# EAGLE schematic printer_v1 (EAGLE 9.6.2)
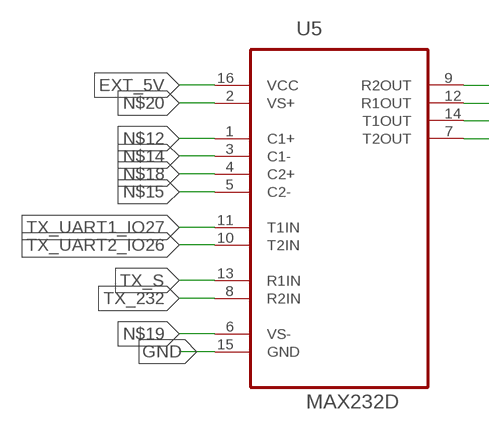
[diagram p0: schematic, sheet 1, part 1 of 2]
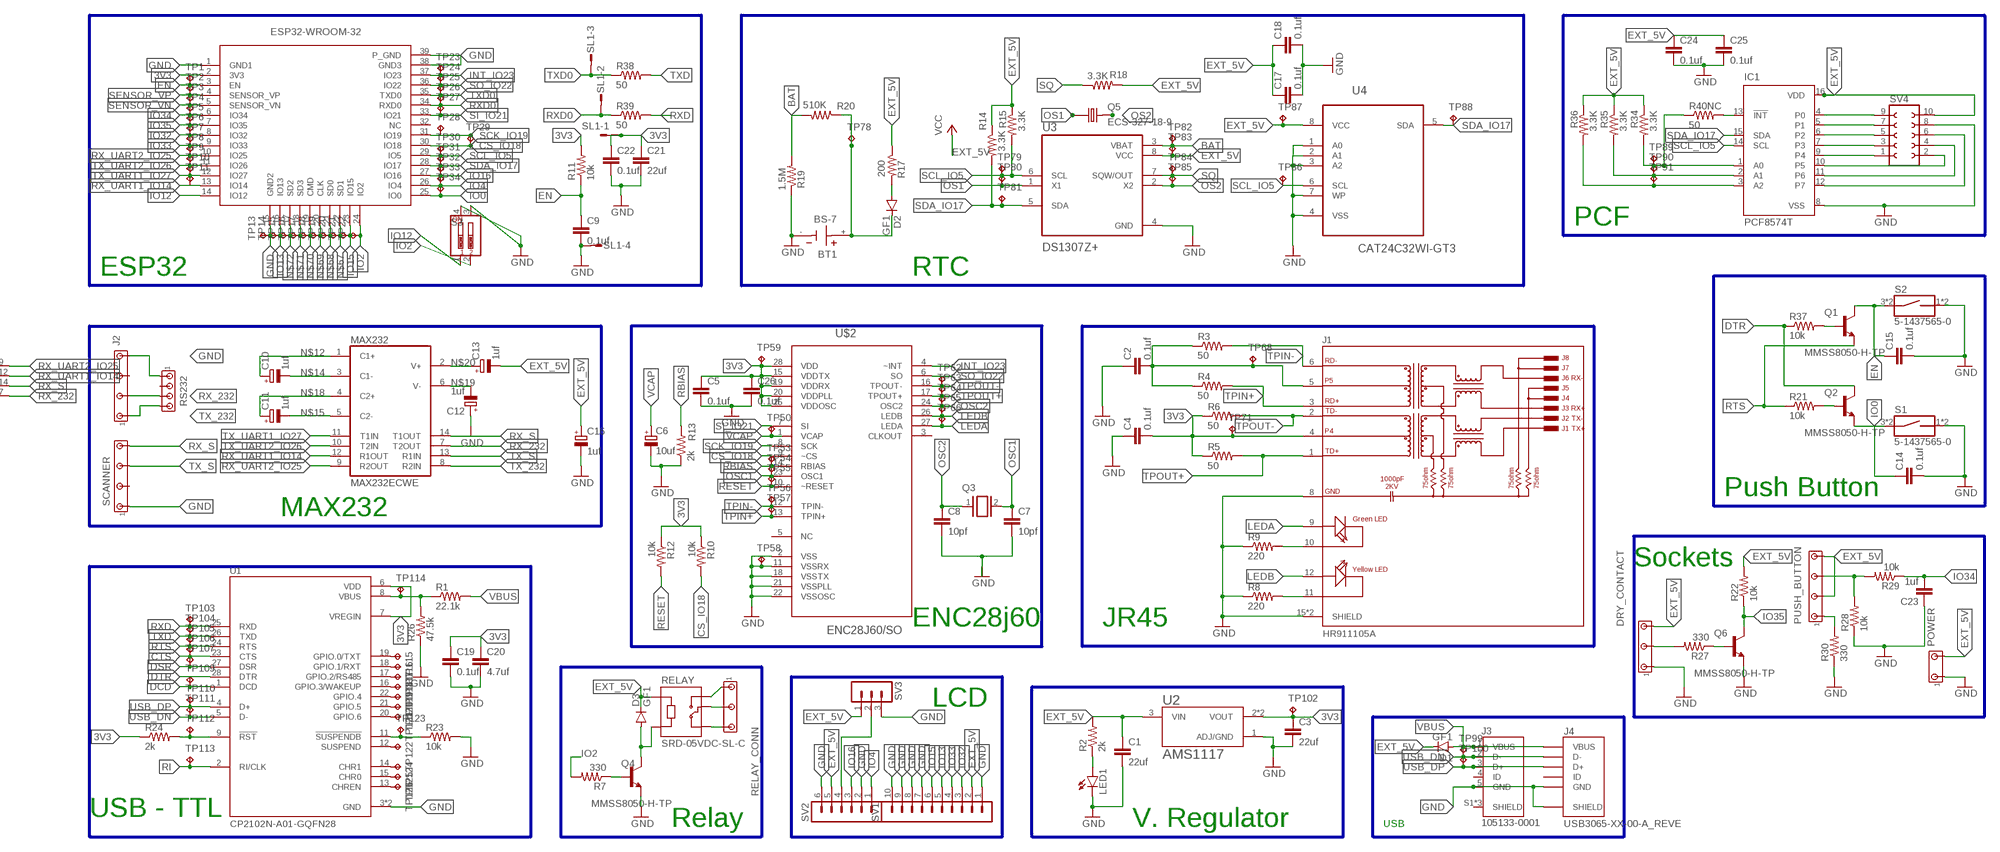
[diagram p1: schematic, sheet 1, part 2 of 2]

## Parts
BT1  BS-7  [BAT_BS-7]
C1  22uf  C-EUC1206  [C1206]
C2  0.1uf  C-EUC1206  [C1206]
C3  22uf  C-EUC1206  [C1206]
C4  0.1uf  C-EUC1206  [C1206]
C5  0.1uf  C-EUC1206  [C1206]
C6  10uf  CPOL-EU153CLV-0405  [153CLV-0405]
C7  10pf  C-EUC1206  [C1206]
C8  10pf  C-EUC1206  [C1206]
C9  0.1uf  C-EUC1206  [C1206]
C10  1uf  CPOL-EU153CLV-0405  [153CLV-0405]
C11  1uf  CPOL-EU153CLV-0405  [153CLV-0405]
C12  1uf  CPOL-EU153CLV-0405  [153CLV-0405]
C13  1uf  CPOL-EU153CLV-0405  [153CLV-0405]
C14  0.1uf  C-EUC1206  [C1206]
C15  0.1uf  C-EUC1206  [C1206]
C16  1uf  CPOL-EU153CLV-0405  [153CLV-0405]
C17  0.1uf  C-EUC1206  [C1206]
C18  0.1uf  C-EUC1206  [C1206]
C19  0.1uf  C-EUC1206  [C1206]
C20  4.7uf  C-EUC1206  [C1206]
C21  22uf  C-EUC1206  [C1206]
C22  0.1uf  C-EUC1206  [C1206]
C23  1uf  C-EUC1206  [C1206]
C24  0.1uf  C-EUC1206  [C1206]
C25  0.1uf  C-EUC1206  [C1206]
C26  0.1uf  C-EUC1206  [C1206]
D1  GF1  [SMA-DO214AC]
D2  GF1  [SMA-DO214AC]
D3  GF1  [SMA-DO214AC]
DRY_CONTACT  MTA05-156_MYVSPACE1  [10X05MTA_MYV]
IC1  PCF8574T  [SO16W]
J1  HR911105A  [HANRUN_HR911105A]
J2  MTA07-100_MYV  [10X07MTA_MYV]
J3  105133-0001  [MOLEX_105133-0001]
J4  USB3065-XX-00-A_REVE  [GCT_USB3065-XX-00-A_REVE]
LED1  LEDSML0603  [SML0603]
MAX232  MAX232ECWE  [SO16L]
POWER  MTA03-100_MYV  [10X03MTA_MYV]
PUSH_BUTTON  MTA07-100_MYV  [10X07MTA_MYV]
Q1  MMSS8050-H-TP  [TRANS_MMSS8050-H-TP]
Q2  MMSS8050-H-TP  [TRANS_MMSS8050-H-TP]
Q3  XTAL/S  [QS]
Q4  MMSS8050-H-TP  [TRANS_MMSS8050-H-TP]
Q5  ECS-327-18-9  [XTAL_ECS-160-18-9X]
Q6  MMSS8050-H-TP  [TRANS_MMSS8050-H-TP]
R1  22.1k  R-US_R1206  [R1206]
R2  2k  R-US_R1206  [R1206]
R3  50  R-US_R1206  [R1206]
R4  50  R-US_R1206  [R1206]
R5  50  R-US_R1206  [R1206]
R6  50  R-US_R1206  [R1206]
R7  330  R-US_R1206  [R1206]
R8  220  R-US_R1206  [R1206]
R9  220  R-US_R1206  [R1206]
R10  10k  R-US_R0805  [R0805]
R11  10k  R-US_R0805  [R0805]
R12  10k  R-US_R0805  [R0805]
R13  2k  R-US_R1206  [R1206]
R14  3.3K  R-US_R1206  [R1206]
R15  3.3K  R-US_R1206  [R1206]
R17  200  R-US_R1206  [R1206]
R18  3.3K  R-US_R1206  [R1206]
R19  1.5M  R-US_R1206  [R1206]
R20  510K  R-US_R1206  [R1206]
R21  10k  R-US_R0805  [R0805]
R22  10k  R-US_R0805  [R0805]
R23  10k  R-US_R0805  [R0805]
R24  2k  R-US_R1206  [R1206]
R26  47.5k  R-US_R1206  [R1206]
R27  330  R-US_R1206  [R1206]
R28  10k  R-US_R0805  [R0805]
R29  10k  R-US_R0805  [R0805]
R30  330  R-US_R1206  [R1206]
R34  3.3K  R-US_R1206  [R1206]
R35  3.3K  R-US_R1206  [R1206]
R36  3.3K  R-US_R1206  [R1206]
R37  10k  R-US_R0805  [R0805]
R38  50  R-US_R0402  [R0402]
R39  50  R-US_R0402  [R0402]
R40NC  50  R-US_R0402  [R0402]
RELAY  SRD-05VDC-SL-C  [RELAY_SRD-05VDC-SL-C]
RELAY_CONN  MTA05-156_MYVSPACE1  [10X05MTA_MYV]
RS232  MTA04-100  [10X04MTA]
S1  5-1437565-0  [SW_5-1437565-0]
S2  5-1437565-0  [SW_5-1437565-0]
S3  SW_DIP-2  [EDG-02]
SCANNER  MTA07-100_MYV  [10X07MTA_MYV]
SL1  M04S  [04P]
SV1  MA10-1  [MA10-1]
SV2  MA06-1  [MA06-1]
SV3  MA03-1  [MA03-1]
SV4  FE05-2  [FE05-2]
TP1  TPTP06R  [TP06R]
TP2  TPTP06R  [TP06R]
TP3  TPTP06R  [TP06R]
TP4  TPTP06R  [TP06R]
TP5  TPTP06R  [TP06R]
TP6  TPTP06R  [TP06R]
TP7  TPTP06R  [TP06R]
TP8  TPTP06R  [TP06R]
TP9  TPTP06R  [TP06R]
TP10  TPTP06R  [TP06R]
TP11  TPTP06R  [TP06R]
TP13  TPTP06R  [TP06R]
TP14  TPTP06R  [TP06R]
TP15  TPTP06R  [TP06R]
TP16  TPTP06R  [TP06R]
TP17  TPTP06R  [TP06R]
TP18  TPTP06R  [TP06R]
TP19  TPTP06R  [TP06R]
TP20  TPTP06R  [TP06R]
TP21  TPTP06R  [TP06R]
TP22  TPTP06R  [TP06R]
TP23  TPTP06R  [TP06R]
TP24  TPTP06R  [TP06R]
TP25  TPTP06R  [TP06R]
TP26  TPTP06R  [TP06R]
TP27  TPTP06R  [TP06R]
TP28  TPTP06R  [TP06R]
TP29  TPTP06R  [TP06R]
TP30  TPTP06R  [TP06R]
TP31  TPTP06R  [TP06R]
TP32  TPTP06R  [TP06R]
TP33  TPTP06R  [TP06R]
TP34  TPTP06R  [TP06R]
TP50  TPTP06R  [TP06R]
TP53  TPTP06R  [TP06R]
TP54  TPTP06R  [TP06R]
TP55  TPTP06R  [TP06R]
TP56  TPTP06R  [TP06R]
TP57  TPTP06R  [TP06R]
TP58  TPTP06R  [TP06R]
TP59  TPTP06R  [TP06R]
TP62  TPTP06R  [TP06R]
TP63  TPTP06R  [TP06R]
TP64  TPTP06R  [TP06R]
TP65  TPTP06R  [TP06R]
TP66  TPTP06R  [TP06R]
TP68  TPTP06R  [TP06R]
TP71  TPTP06R  [TP06R]
TP78  TPTP06R  [TP06R]
TP79  TPTP06R  [TP06R]
TP80  TPTP06R  [TP06R]
TP81  TPTP06R  [TP06R]
TP82  TPTP06R  [TP06R]
TP83  TPTP06R  [TP06R]
TP84  TPTP06R  [TP06R]
TP85  TPTP06R  [TP06R]
TP86  TPTP06R  [TP06R]
TP87  TPTP06R  [TP06R]
TP88  TPTP06R  [TP06R]
TP89  TPTP06R  [TP06R]
TP90  TPTP06R  [TP06R]
TP91  TPTP06R  [TP06R]
TP99  TPTP06R  [TP06R]
TP100  TPTP06R  [TP06R]
TP102  TPTP06R  [TP06R]
TP103  TPTP06R  [TP06R]
TP104  TPTP06R  [TP06R]
TP105  TPTP06R  [TP06R]
TP106  TPTP06R  [TP06R]
TP107  TPTP06R  [TP06R]
TP109  TPTP06R  [TP06R]
TP110  TPTP06R  [TP06R]
TP111  TPTP06R  [TP06R]
TP112  TPTP06R  [TP06R]
TP113  TPTP06R  [TP06R]
TP114  TPTP06R  [TP06R]
TP115  TPTP06R  [TP06R]
TP116  TPTP06R  [TP06R]
TP117  TPTP06R  [TP06R]
TP118  TPTP06R  [TP06R]
TP119  TPTP06R  [TP06R]
TP120  TPTP06R  [TP06R]
TP121  TPTP06R  [TP06R]
TP122  TPTP06R  [TP06R]
TP123  TPTP06R  [TP06R]
TP124  TPTP06R  [TP06R]
TP125  TPTP06R  [TP06R]
TP126  TPTP06R  [TP06R]
U1  CP2102N-A01-GQFN28  [QFN50P500X500X80-29N]
U2  AMS1117  [SOT229P700X180-4N]
U3  DS1307Z+  [SOIC127P600X175-8N]
U4  CAT24C32WI-GT3  [SOIC127P600X175-8N]
U5  MAX232D  [SOIC127P600X175-16N]
U$2  ENC28J60/SO  [SOIC127P1034X264-28N]
U$3  ESP32-WROOM-32  [ESP32-WROOM-32]

## Nets
3V3 [POWER]: C3.1 C4.2 C5.1 C19.1 C20.1 C21.1 C22.1 C26.1 J1.4 R5.1 R6.1 R10.1 R11.2 R12.1 R24.1 SL1.1 TP59.TP TP71.TP TP102.TP U1.6(VDD) U1.7(VREGIN) U2.2(VOUT) U2.4(VOUT) U$2.15(VDDTX) U$2.19(VDDRX) U$2.20(VDDPLL) U$2.25(VDDOSC) U$2.28(VDD) U$3.2(3V3)
BAT: R19.2 R20.2 TP82.TP U3.3(VBAT)
CS_IO18: R10.2 TP29.TP U$2.9(~CS) U$3.30(IO18)
CTS: TP106.TP U1.23(CTS)
DCD: TP109.TP U1.1(DCD)
DSR: TP107.TP U1.27(DSR)
DTR: Q2.3(C) R37.1 U1.28(DTR)
EN: C9.1 C15.1 Q1.3(C) R11.1 S2.3 S2.4 TP1.TP U$3.3(EN)
EXT_5V [POWER]: C1.1 C13.- C16.+ C17.1 C18.1 C24.1 C25.1 D1.K(C) D3.K(C) DRY_CONTACT.5 IC1.16(VDD) POWER.3 PUSH_BUTTON.3 PUSH_BUTTON.7 R2.2 R14.1 R15.1 R17.1 R18.2 R22.2 R34.1 R35.1 R36.1 RELAY.A1 SV1.2 SV2.5 SV3.1 SV4.10 TP83.TP TP87.TP U2.3(VIN) U3.8(VCC) U4.8(VCC) U5.16(VCC) ; supply symbol labelled VCC
GND [POWER]: BT1.- C1.2 C2.1 C3.2 C4.1 C5.2 C6.- C7.2 C8.2 C9.2 C12.+ C14.2 C15.2 C16.- C17.2 C18.2 C19.2 C20.2 C21.2 C22.2 C23.1 C24.2 C25.2 C26.2 DRY_CONTACT.1 IC1.8(VSS) J1.8(GND) J1.15(SHIELD) J1.16(SHIELD) J2.7 J3.5(GND) J4.5(GND) J4.6(SHIELD) J4.7(SHIELD) J4.8(SHIELD) J4.9(SHIELD) LED1.C POWER.1 Q4.2(E) Q6.2(E) R8.1 R9.1 R13.1 R19.1 R23.2 R26.1 R28.1 R30.1 RS232.1 S1.1 S1.2 S2.1 S2.2 S3.3 S3.4 SCANNER.1 SL1.4 SV1.1 SV1.7 SV1.8 SV1.9 SV1.10 SV2.2 SV2.6 SV3.3 SV4.8 TP13.TP TP58.TP U1.3(GND) U1.29(GND) U2.1(ADJ/GND) U3.4(GND) U4.1(A0) U4.2(A1) U4.3(A2) U4.4(VSS) U4.7(WP) U5.15(GND) U$2.2(VSS) U$2.11(VSSRX) U$2.18(VSSTX) U$2.21(VSSPLL) U$2.22(VSSOSC) U$3.1(GND1) U$3.15(GND2) U$3.38(GND3) U$3.39(P_GND)
INT_IO23: TP23.TP U$2.4(~INT) U$3.37(IO23)
IO0: C14.1 Q2.2(E) S1.3 S1.4 TP34.TP U$3.25(IO0)
IO2: R7.2 S3.2 TP22.TP U$3.24(IO2)
IO4: SV2.1 TP33.TP U$3.26(IO4)
IO12: S3.1 U$3.14(IO12)
IO13: SV1.5 TP14.TP U$3.16(IO13)
IO15: SV1.6 TP21.TP U$3.23(IO15)
IO16: SV2.3 TP32.TP U$3.27(IO16)
IO32: SV1.3 TP6.TP U$3.8(IO32)
IO33: SV1.4 TP7.TP U$3.9(IO33)
IO34: C23.2 R29.1 TP4.TP U$3.6(IO34)
IO35: Q6.3(C) R22.1 TP5.TP U$3.7(IO35)
LEDA: J1.9(GA) TP66.TP U$2.27(LEDA)
LEDB: J1.12(YA) TP65.TP U$2.26(LEDB)
N$1: LED1.A R2.1
N$2: Q1.1(B) R37.2
N$3: Q2.1(B) R21.2
N$4: R1.1 R26.2 TP114.TP U1.8(VBUS)
N$5: SV2.4 SV3.2
N$6: R23.1 TP123.TP U1.11(!SUSPENDB)
N$7: J1.11(YC) R8.2
N$8: C2.2 J1.5 R3.1 R4.1 TP68.TP
N$9: J1.10(GC) R9.2
N$10: TP115.TP U1.19(GPIO.0/TXT)
N$11: TP116.TP U1.18(GPIO.1/RXT)
N$12: C10.+ MAX232.1(C1+) U5.1(C1+)
N$13: TP117.TP U1.17(GPIO.2/RS485)
N$14: C10.- MAX232.3(C1-) U5.3(C1-)
N$15: C11.- MAX232.5(C2-) U5.5(C2-)
N$16: R24.2 TP112.TP U1.9(!RST)
N$17: TP118.TP U1.16(GPIO.3/WAKEUP)
N$18: C11.+ MAX232.4(C2+) U5.4(C2+)
N$19: C12.- MAX232.6(V-) U5.6(VS-)
N$20: C13.+ MAX232.2(V+) U5.2(VS+)
N$21: RELAY.NC RELAY_CONN.5
N$22: RELAY.COM RELAY_CONN.3
N$23: IC1.9(P4) SV4.1
N$24: IC1.13(!INT) R40NC.2
N$25: TP119.TP U1.22(GPIO.4)
N$26: RELAY.NO RELAY_CONN.1
N$27: D3.A Q4.3(C) RELAY.A2
N$28: D2.A R17.2
N$29: BT1.+ D2.K(C) R20.1 TP78.TP
N$30: TP120.TP U1.21(GPIO.5)
N$31: TP121.TP U1.20(GPIO.6)
N$32: Q6.1(B) R27.1
N$33: PUSH_BUTTON.5 R28.2 R29.2
N$34: TP122.TP U1.12(SUSPEND)
N$35: DRY_CONTACT.3 R27.2
N$36: IC1.7(P3) SV4.3
N$37: IC1.6(P2) SV4.5
N$38: IC1.5(P1) SV4.7
N$39: TP124.TP U1.14(CHR1)
N$40: PUSH_BUTTON.1 R30.2
N$41: TP125.TP U1.15(CHR0)
N$42: TP126.TP U1.13(CHREN)
N$43: IC1.4(P0) SV4.9
N$44: IC1.10(P5) SV4.2
N$45: IC1.1(A0) R34.2 R40NC.1 TP89.TP
N$46: IC1.2(A1) R35.2 TP90.TP
N$47: IC1.3(A2) R36.2 TP91.TP
N$48: IC1.11(P6) SV4.4
N$49: IC1.12(P7) SV4.6
N$50: Q4.1(B) R7.1
N$67: TP20.TP U$3.22(SD1)
N$68: TP19.TP U$3.21(SD0)
N$69: TP18.TP U$3.20(CLK)
N$70: TP17.TP U$3.19(CMD)
N$71: TP16.TP U$3.18(SD3)
N$72: TP15.TP U$3.17(SD2)
OS1: Q5.1 TP80.TP U3.1(X1)
OS2: Q5.2 TP85.TP U3.2(X2)
OSC1: C7.1 Q3.2 TP54.TP U$2.23(OSC1)
OSC2: C8.1 Q3.1 TP64.TP U$2.24(OSC2)
RBIAS: R13.2 TP53.TP U$2.14(RBIAS)
RESET: R12.2 TP55.TP U$2.10(~RESET)
RI: TP113.TP U1.2(RI/CLK)
RTS: Q1.2(E) R21.1 TP105.TP U1.24(RTS)
RX_232: J2.3 MAX232.7(T2OUT) RS232.3 U5.7(T2OUT)
RX_S: MAX232.14(T1OUT) SCANNER.7 U5.14(T1OUT)
RX_UART1_IO14: MAX232.12(R1OUT) TP11.TP U5.12(R1OUT) U$3.13(IO14)
RX_UART2_IO25: MAX232.9(R2OUT) TP8.TP U5.9(R2OUT) U$3.10(IO25)
RXD: R39.2 TP103.TP U1.25(RXD)
RXD0: R39.1 SL1.2 TP26.TP U$3.34(RXD0)
SCK_IO19: TP28.TP U$2.8(SCK) U$3.31(IO19)
SCL_IO5: IC1.14(SCL) R15.2 TP30.TP TP79.TP TP86.TP U3.6(SCL) U4.6(SCL) U$3.29(IO5)
SDA_IO17: IC1.15(SDA) R14.2 TP31.TP TP81.TP TP88.TP U3.5(SDA) U4.5(SDA) U$3.28(IO17)
SENSOR_VN: TP3.TP U$3.5(SENSOR_VN)
SENSOR_VP: TP2.TP U$3.4(SENSOR_VP)
SI_IO21: TP27.TP U$2.7(SI) U$3.33(IO21)
SO_IO22: TP24.TP U$2.6(SO) U$3.36(IO22)
SQ: R18.1 TP84.TP U3.7(SQW/OUT)
TPIN+: J1.3(RD+) R4.2 TP57.TP U$2.13(TPIN+)
TPIN-: J1.6(RD-) R3.2 TP56.TP U$2.12(TPIN-)
TPOUT+: J1.1(TD+) R5.2 TP63.TP U$2.17(TPOUT+)
TPOUT-: J1.2(TD-) R6.2 TP62.TP U$2.16(TPOUT-)
TX_232: J2.1 MAX232.8(R2IN) RS232.4 U5.8(R2IN)
TX_S: MAX232.13(R1IN) SCANNER.5 U5.13(R1IN)
TX_UART1_IO27: MAX232.11(T1IN) TP10.TP U5.11(T1IN) U$3.12(IO27)
TX_UART2_IO26: MAX232.10(T2IN) TP9.TP U5.10(T2IN) U$3.11(IO26)
TXD: R38.2 TP104.TP U1.26(TXD)
TXD0: R38.1 SL1.3 TP25.TP U$3.35(TXD0)
USB_DN: J3.2(D-) J4.2(D-) TP99.TP TP111.TP U1.5(D-)
USB_DP: J3.3(D+) J4.3(D+) TP100.TP TP110.TP U1.4(D+)
VBUS [POWER]: D1.A J3.1(VBUS) J4.1(VBUS) R1.2
VCAP: C6.+ TP50.TP U$2.1(VCAP)
Unconnected: J2.5 J3.4(ID) J3.S1(SHIELD) J3.S2(SHIELD) J3.S3(SHIELD) J4.4(ID) RS232.2 SCANNER.3 U$2.3(CLKOUT) U$2.5(NC) U$3.32(NC)

## Buses
B$1
B$2
BAT,EXT_5V,GND,N$28,N$29
B$3
B$4
B$5
B$6
B$7
EXT_5V_PIN,GND
B$8
3V3,CTS,DCD,DSR,DTR,GND,N$4,N$6,N$16,RI,RTS,RXD,TXD,USB_DN,USB_DP,VBUS
B$9
B$10

## Notes on the sheet
- PCF
- ESP32 | RTC
- Push Button
- MAX232
- Sockets
- ENC28j60 | JR45
- LCD
- USB - TTL
- Relay | V. Regulator | USB

## Power pins joined to a net without a drawn wire
EXT_5V: MAX232.16(VCC)
GND: MAX232.15(GND)

## Library data of the parts
BT1 = BS-7:BS-7: BATTERY HOLDER COIN 20MM PC PIN; AVAILABILITY: Unavailable; DESCRIPTION: BATTERY HOLDER COIN 20MM PC PIN; MF: MPD _Memory; MP: BS-7; PACKAGE: None; PRICE: None
C1-C5 C7-C9 C14 C15 C17-C26 = rcl:C-EU: CAPACITOR, European symbol; SPICEPREFIX: C
C6 C10-C13 C16 = rcl:CPOL-EU: POLARIZED CAPACITOR, European symbol; SPICEPREFIX: C
D1-D3 = diode:GF1: DIODE
DRY_CONTACT RELAY_CONN = con-amp_edit:MTA05-156_MYV: AMP connector
IC1 = micro-philips:PCF8574: I2C-Bus Remote 8-bit I/O expander http://www.semiconductors.philips.com/acrobat_download/datasheets/PCF8574_4.pdf; MPN: PCF8574T/3,512; OC_FARNELL: 1201255; OC_NEWARK: 70R6870
J1 = HR911105A:HR911105A: DIP RJ45 Connector;; AVAILABILITY: Unavailable; DESCRIPTION: HR911105A Ethernet Interface Arduino Platform Evaluation Expansion Board; MF: DFRobot; MP: HR911105A; PACKAGE: None; PRICE: None
J2 PUSH_BUTTON SCANNER = con-amp_edit:MTA07-100_MYV: AMP connector
J3 = 105133-0001:105133-0001: Conn Micro USB Type B RCP 5 POS 0.65mm Solder RA SMD 5 Terminal 1 Port Embossed T/R; AVAILABILITY: Unavailable; DESCRIPTION: USB - micro B USB 2.0 Receptacle Connector 5 Position Surface Mount; MF: Molex; MP: 105133-0001; PACKAGE: None; PRICE: None
J4 = USB3065-XX-00-A_REVE:USB3065-XX-00-A_REVE: Micro USB Receptacle, Type B, 5 Pin, SMT, Horizontal, Bottom Mount (Standart), Optional Plastic Locating Peg; AVAILABILITY: Unavailable; DESCRIPTION: USB3065 Series 5 Pin, SMT, Horizontal, Bottom Mount, Micro USB Receptacle; MF: Global Connector Technology; MP: USB3065-30-00-A; PACKAGE: None; PRICE: None
LED1 = led:LED: LED OSRAM: - CHIPLED LG R971, LG N971, LY N971, LG Q971, LY Q971, LO R971, LY R971 LH N974, LH R974 LS Q976, LO Q976, LY Q976 LO Q996 - Hyper CHIPLED LW Q18S LB Q993, LB Q99A, LB R99A - SideLED LS A670, LO A670, LY A670, LG A670, LP A670 LB A673, LV A673, LT A673, LW A673 LH A674 LY A675 LS A676, LA A676, LO A676, LY A676, LW A676 LS A679, LY A679, LG A679 - Hyper Micro SIDELED® LS Y876, LA Y876, LO Y876, LY Y876 LT Y87S - SmartLED LW L88C, LW L88S LB L89C, LB L89S, LG L890 LS L89K, LO L89K, LY L89K LS L896, LA L896, LO L896, LY L896 - TOPLED LS T670, LO T670, LY T670, LG T670, LP T670 LSG T670, LSP T670, LSY T670, LOP T670, LYG T670 LG T671, LOG T671, LSG T671 LB T673, LV T673, LT T673, LW T673 LH T674 LS T676, LA T676, LO T676, LY T676, LB T676, LH T676, LSB T676, LW T676 LB T67C, LV T67C, LT T67C, LS T67K, LO T67K, LY T67K, LW E67C LS E67B, LA E67B, LO E67B, LY E67B, LB E67C, LV E67C, LT E67C LW T67C LS T679, LY T679, LG T679 LS T770, LO T770, LY T770, LG T770, LP T770 LB T773, LV T773, LT T773, LW T773 LH T774 LS E675, LA E675, LY E675, LS T675 LS T776, LA T776, LO T776, LY T776, LB T776 LHGB T686 LT T68C, LB T68C - Hyper Mini TOPLED® LB M676 - Mini TOPLED Santana® LG M470 LS M47K, LO M47K, LY M47K Source: http://www.osram.convergy.de LUXEON: - LUMILED® LXK2-PW12-R00, LXK2-PW12-S00, LXK2-PW14-U00, LXK2-PW14-V00 LXK2-PM12-R00, LXK2-PM12-S00, LXK2-PM14-U00 LXK2-PE12-Q00, LXK2-PE12-R00, LXK2-PE12-S00, LXK2-PE14-T00, LXK2-PE14-U00 LXK2-PB12-K00, LXK2-PB12-L00, LXK2-PB12-M00, LXK2-PB14-N00, LXK2-PB14-P00, LXK2-PB14-Q00 LXK2-PR12-L00, LXK2-PR12-M00, LXK2-PR14-Q00, LXK2-PR14-R00 LXK2-PD12-Q00, LXK2-PD12-R00, LXK2-PD12-S00 LXK2-PH12-R00, LXK2-PH12-S00 LXK2-PL12-P00, LXK2-PL12-Q00, LXK2-PL12-R00 Source: www.luxeon.com KINGBRIGHT: KA-3528ASYC Source: www.kingbright.com
MAX232 = maxim:MAX232ECWE: RS232 TRANSCEIVER; MF: MAXIM; MPN: MAX232ECWE+; OC_FARNELL: 9724435; OC_NEWARK: 67K4440
POWER = con-amp_edit:MTA03-100_MYV: AMP connector
Q1 Q2 Q4 Q6 = MMSS8050-H-TP:MMSS8050-H-TP: MMSS8050-H Series 25 V 1.5 A NPN Silicon Plastic-Encapsulate Transistor-SOT-23; AVAILABILITY: Unavailable; DESCRIPTION: Bipolar _BJT_ Transistor NPN 25V 1.5A 100MHz 625mW Surface Mount SOT-23; MF: Micro Commercial; MP: MMSS8050-H-TP; PACKAGE: SOT-23 Micro Commercial; PRICE: None
Q3 = special:XTAL/S: CRYSTAL
Q5 = ECS-327-18-9:ECS-327-18-9: Crystal Cylindrical Can, Radial; AVAILABILITY: Unavailable; DESCRIPTION: 32.768MHz ±50ppm Crystal 18pF 100 Ohms Cylindrical Can, Radial; MF: ECS International; MP: ECS-327-18-9; PACKAGE: Cylindrical Can Radial ECS International; PRICE: None
R1-R15 R17-R24 R26-R30 R34-R39 R40NC = rcl:R-US_: RESISTOR, American symbol; SPICEPREFIX: R
RELAY = SRD-05VDC-SL-C:SRD-05VDC-SL-C: 5V Trigger Relay Module For Arduino And Raspberry Pi 5V Trigger Relay Module For Arduino And Raspberry Pi; AVAILABILITY: Unavailable; DESCRIPTION: 5V Trigger Relay Module For Arduino And Raspberry Pi 5V Trigger Relay Module For Arduino And Raspberry Pi; MF: Songle Relay; MP: SRD-05VDC-SL-C; PACKAGE: None; PRICE: None
RS232 = con-amp:MTA04-100: AMP connector
S1 S2 = 5-1437565-0:5-1437565-0: Switch Tactile OFF (ON) Round Button Gull Wing 0.05A 12VDC 1.57N SMD T/R; AVAILABILITY: Unavailable; COMMENT: 5-1437565-0; DESCRIPTION: Switch Push Button N.O. SPST Round Button 0.05A 12VDC 1VA Alternate Contact Gull Wing SMD T/R; MF: TE Connectivity; MP: FSM6JSMATR; PACKAGE: None; PRICE: None; TE_PURCHASE_URL: https://www.te.com/usa-en/product-5-1437565-0.html?te_bu=Cor&te_type=disp&te_campaign=seda_glo_cor-seda-global-disp-prtnr-fy19-seda-model-bom-cta_sma-317_1&elqCampaignId=32493
S3 = special:SW_DIP-2: DIP SWITCH
SL1 = con-amp-quick:M04S: AMP QUICK CONNECTOR; OC_FARNELL: unknown; OC_NEWARK: unknown
SV1 = con-lstb:MA10-1: PIN HEADER; OC_FARNELL: unknown; OC_NEWARK: unknown
SV2 = con-lstb:MA06-1: PIN HEADER; OC_FARNELL: unknown; OC_NEWARK: unknown
SV3 = con-lstb:MA03-1: PIN HEADER; OC_FARNELL: unknown; OC_NEWARK: unknown
SV4 = con-lsta:FE05-2: FEMALE HEADER; OC_FARNELL: unknown; OC_NEWARK: unknown
TP1-TP11 TP13-TP34 TP50 TP53-TP59 TP62-TP66 TP68 TP71 TP78-TP91 TP99 TP100 TP102-TP107 TP109-TP126 = testpad:TP: Test pad
U1 = CP2102N-A01-GQFN28:CP2102N-A01-GQFN28: Ic Bridge Usb To Uart 28qfn; DESCRIPTION: USB Bridge, USB to UART USB 2.0 UART Interface 28-QFN _5x5_; DIGI-KEY_PART_NUMBER: 336-3694-ND; DIGI-KEY_PURCHASE_URL: https://www.digikey.com/product-detail/en/silicon-labs/CP2102N-A01-GQFN28/336-3694-ND/6012519?utm_source=snapeda&utm_medium=aggregator&utm_campaign=symbol; MF: Silicon Labs; MP: CP2102N-A01-GQFN28; PACKAGE: QFN-28 Silicon Labs
U2 = AMS1117:AMS1117: Sot223/Pkg 1-Amp 5-Volt Low Drop Out Voltage Regulatator; AVAILABILITY: Unavailable; DESCRIPTION: UNO PLUS Arduino R3 Shield, Xbee Arduino IDE Wheeled Robotics Kit; MF: Seeed Technology; MP: AMS1117; PACKAGE: SOT-223 Seeed Technology; PRICE: None
U3 = DS1307Z_:DS1307Z+; AVAILABILITY: Unavailable; DESCRIPTION: Real Time Clock _RTC_ IC Clock/Calendar 56B I²C, 2-Wire Serial 8-SOIC _0.154, 3.90mm Width_; MF: Maxim Integrated; MP: DS1307Z; PACKAGE: SO-8 Maxim Integrated; PRICE: None
U4 = CAT24C32WI-GT3:CAT24C32WI-GT3: 32-Kb I2C CMOS Serial EEPROM; AVAILABILITY: Unavailable; DESCRIPTION: EEPROM Memory IC 32Kb _4K x 8_ I²C 1MHz 400ns 8-SOIC; MF: ON; MP: CAT24C32WI-GT3; PACKAGE: SOIC-8 ON; PRICE: None
U5 = MAX232D:MAX232D: DUAL EIA-232 DRIVERS/RECEIVERS; AVAILABILITY: Unavailable; DESCRIPTION: 2/2 Transceiver Full RS232 16-SOIC; MF: Texas Instruments; MP: MAX232D; PACKAGE: SOIC-16 Texas Instruments; PRICE: None
U$2 = ENC28J60_SO:ENC28J60/SO: Stand-Alone Ethernet Controller;; AVAILABILITY: Unavailable; DESCRIPTION: Ethernet Controller 10 Base-T PHY SPI Interface 28-SSOP; MF: Microchip; MP: ENC28J60/SS; PACKAGE: SSOP-28 Microchip; PRICE: None
U$3 = ESP32-WROOM-32:ESP32-WROOM-32: ESP32-WROOM-32 Module; AVAILABILITY: Unavailable; DESCRIPTION: Bluetooth, WiFi Transceiver Module 2.4GHz ~ 2.5GHz Surface Mount; MF: Espressif Systems; MP: ESP32-WROOM-32; PACKAGE: Module Espressif Systems; PRICE: None

## Net classes
1 POWER: width 0.254 mm